# EAGLE design FSR Input LM358 (EAGLE 9.6.2)
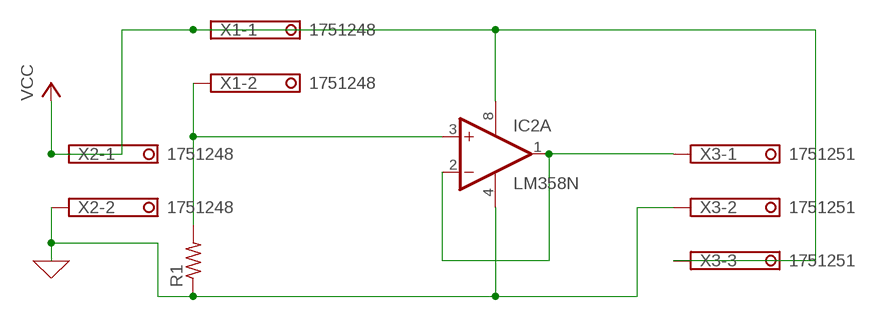
[diagram p0: schematic, sheet 1]

## Parts
IC2  LM358N  [DIL08]
R1  R-US_0204/5  [0204/5]
X1  1751248  [1751248]
X2  1751248  [1751248]
X3  1751251  [1751251]

## Nets
0: IC2.4(P:V-) R1.1 X2.2 X3.2 ; supply symbol labelled GND
N$1: IC2.3(A:+IN) R1.2 X1.2
N$3: IC2.1(A:OUT) IC2.2(A:-IN) X3.1
VCC: IC2.8(P:V+) X1.1 X2.1 X3.3
Unconnected: IC2.5(B:+IN) IC2.6(B:-IN) IC2.7(B:OUT)

## Library data of the parts
IC2 = linear:LM358: OP AMP also LM158; LM258; LM2904 Source: http://cache.national.com/ds/LM/LM158.pdf
R1 = rcl:R-US_: RESISTOR, American symbol; SPICEPREFIX: R
X1 X2 = con-phoenix-350:1751248: MKDS 1/ 2-3,5 Printklemme Nennstrom: 10 A Bemessungsspannung: 160 V Raster: 3,5 mm Polzahl: 2 Montageart: Löten Anschlussart: Schraubanschluss Anschlussrichtung vom Leiter zur Platine: 0° Source: http://eshop.phoenixcontact.com .. 1751248.pdf; OC_FARNELL: unknown; OC_NEWARK: unknown
X3 = con-phoenix-350:1751251: MKDS 1/ 3-3,5 Printklemme Nennstrom: 10 A Bemessungsspannung: 160 V Raster: 3,5 mm Polzahl: 3 Montageart: Löten Anschlussart: Schraubanschluss Anschlussrichtung vom Leiter zur Platine: 0° Source: http://eshop.phoenixcontact.com .. 1751251.pdf; OC_FARNELL: unknown; OC_NEWARK: unknown

## Board
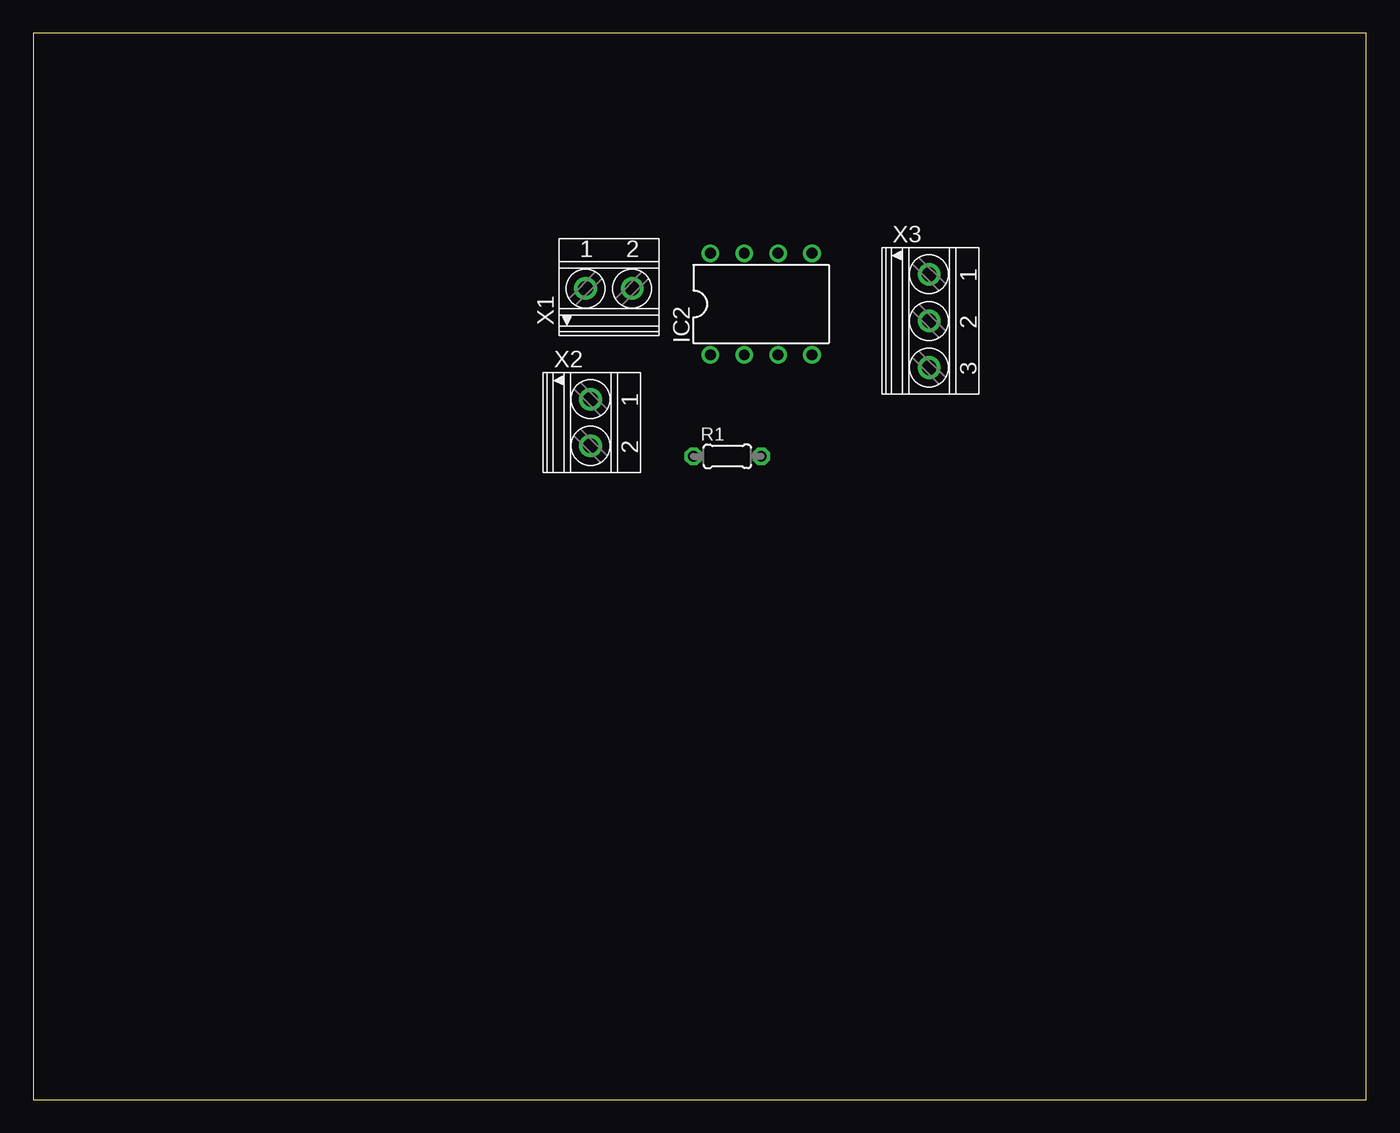
[diagram p1: board, top side]
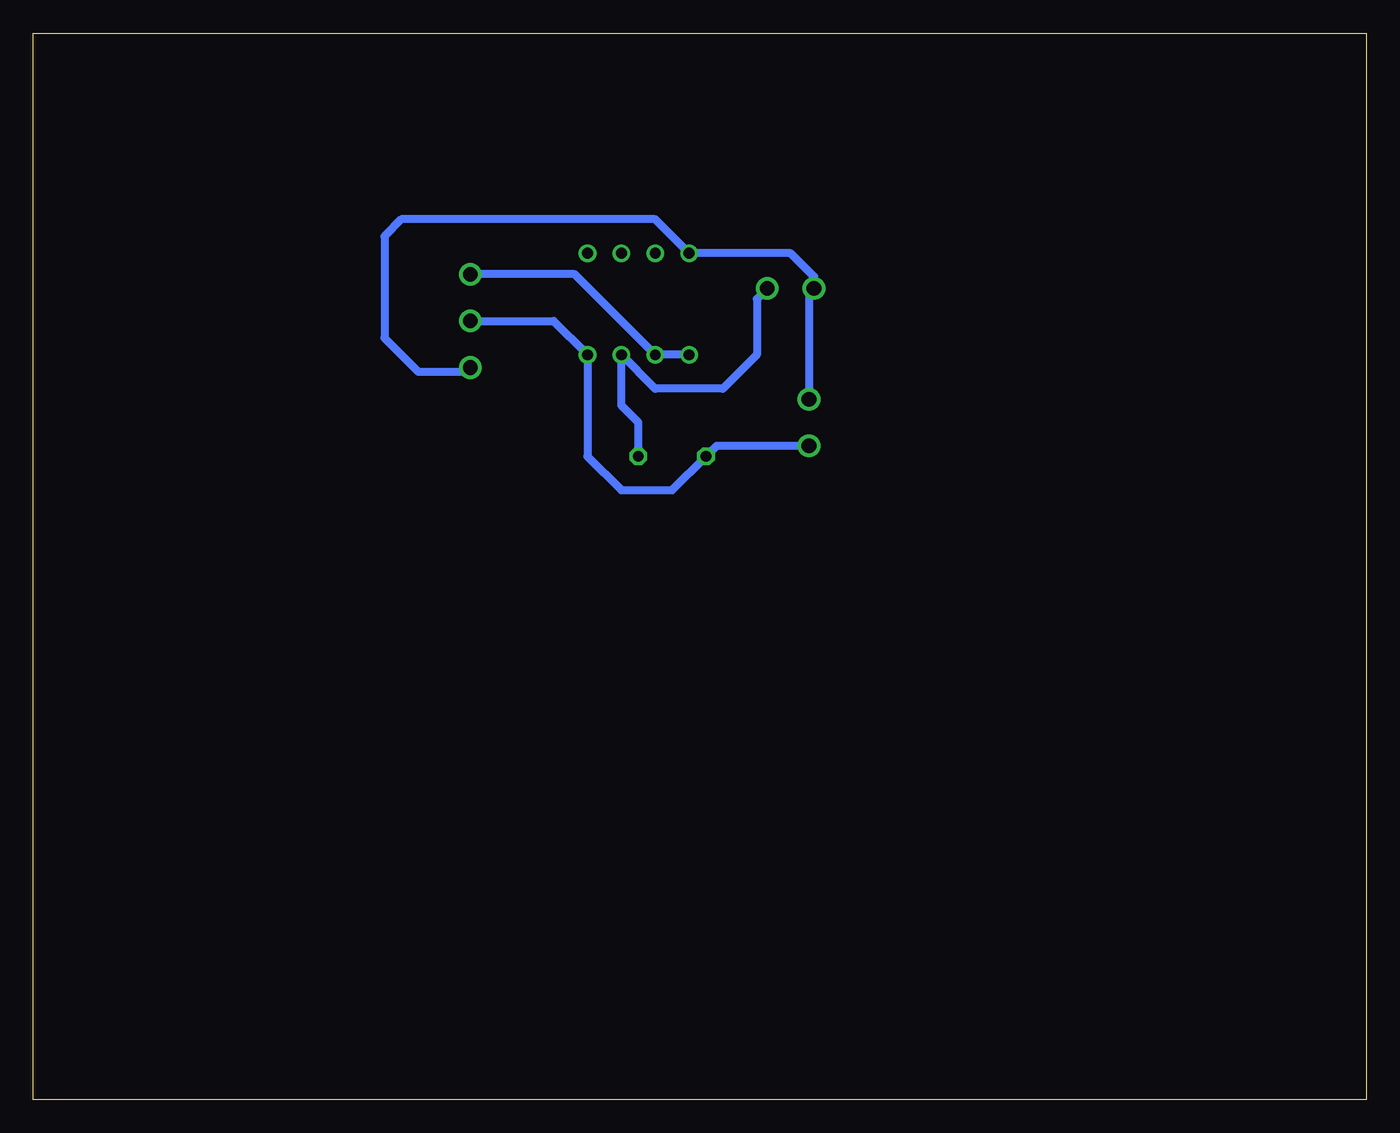
[diagram p2: board, bottom side, seen from below]

Size 100 x 80 mm. Coordinates in mm from the lower left corner, seen from the top.
Outline: 0,0 100,0 100,80 0,80 0,0
Copper layers (1*16): Top 0.035mm / dielectric 1.5mm / Bottom 0.035mm
Design rules "default": minimum track width 6mil, minimum drill 0.35mm, track to track 6mil, track to pad 6mil, pad to pad 6mil, via to via 6mil, smd to smd 6mil, copper to edge 40mil, drill to drill 6mil, minimum pad ring 10mil, minimum via ring 8mil, stop-mask expansion 4mil, vias tented up to drill 0mil, thermal gap 10mil

### Footprints (pad centres in the part's own frame; a part is rotated, then mirrored left to right if it is on the bottom)
DIL08 = drill 0.813 pad 1.27: 1 -3.81,-3.81; 2 -1.27,-3.81; 3 1.27,-3.81; 4 3.81,-3.81; 5 3.81,3.81; 6 1.27,3.81; 7 -1.27,3.81; 8 -3.81,3.81
0204/5 = drill 0.813 octagon: 1 -2.54,0; 2 2.54,0
1751248 = drill 1.1 pad 1.7: 1 -1.75,-0.1; 2 1.75,-0.1
1751251 = drill 1.1 pad 1.7: 1 -3.5,-0.1; 2 0,-0.1; 3 3.5,-0.1

### Placement (x,y rotation side)
IC2  54.61,59.69 0 top
R1  52.07,48.26 0 top
X1  43.18,60.96 0 top
X2  41.91,50.8 270 top
X3  67.31,58.42 270 top

### Tracks (layer width: path | path; a pad name or v marks a point on that pad's centre or on a via)
0
  Bottom 0.61: 41.91,48.95 X2.2 48.74,49.05 R1.1 52.07,45.72 55.88,45.72 58.42,48.26 IC2.4 60.96,58.42 X3.2 67.31,58.42
N$1
  Bottom 0.61: R1.2 54.61,50.8 55.88,52.07 IC2.3 53.34,53.34 48.26,53.34 45.72,55.88 45.72,60.07 X1.2
N$3
  Bottom 0.61: IC2.1 IC2.2 59.38,61.92 X3.1
VCC
  Bottom 0.61: X2.1 41.81,60.48 X1.1 41.43,61.75 43.18,63.5 IC2.8 53.34,66.04 72.39,66.04 73.66,64.77 73.66,57.15 71.12,54.61 67.52,54.61 X3.3